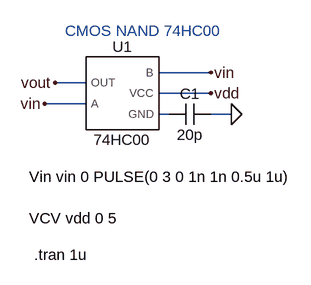
[diagram p0: schematic test74hc00.asc]
test74hc00.asc, the LTspice schematic file:
Version 4
SHEET 1 880 680
WIRE 320 32 240 32
WIRE 128 48 80 48
WIRE 320 64 240 64
WIRE 128 80 64 80
WIRE 256 96 240 96
WIRE 352 96 320 96
FLAG 64 80 vin
FLAG 320 32 vin
FLAG 320 64 vdd
FLAG 352 96 0
FLAG 80 48 vout
SYMBOL AutoGenerated\\CD74HC00 176 64 R0
SYMATTR InstName U1
SYMBOL cap 320 80 R90
WINDOW 0 0 32 VBottom 2
WINDOW 3 32 32 VTop 2
SYMATTR InstName C1
SYMATTR Value 20p
TEXT 40 192 Left 2 !Vin vin 0 PULSE(0 3 0 1n 1n 0.5u 1u)
TEXT 48 312 Left 2 !.tran 1u
TEXT 40 256 Left 2 !VCV vdd 0 5
TEXT 96 -32 Left 2 ;CMOS NAND 74HC00

The netlist it stands for:
* test74hc00.asc
XU1 vout vin vin vdd N001 74HC00  ; pins OUT A B VCC GND
C1 0 N001 20p
Vin vin 0 PULSE(0 3 0 1n 1n 0.5u 1u)
.tran 1u
VCV vdd 0 5
* CMOS NAND 74HC00
.lib C:\Users\RJ\Documents\LTspiceXVII\gates\CD74HC00.cir
.backanno
.end

* Results of the author's LTspice run, read from the files saved beside the schematic
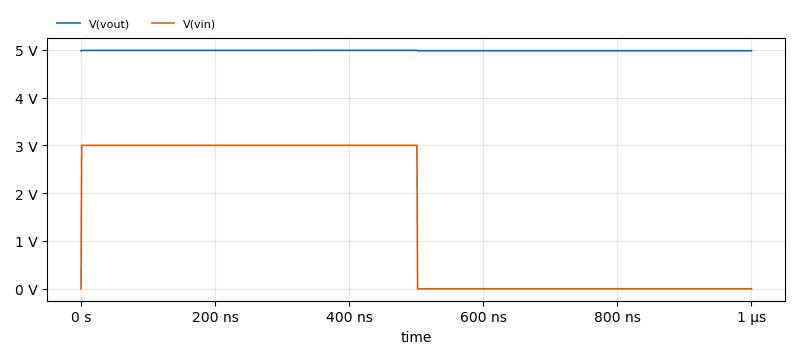
[diagram p1: Transient Analysis of test74hc00.asc, plotted from the saved traces]
* Transient Analysis, 1 run:
*   V(vout): min 4.979 V, max 4.987 V, average 4.982 V, rms 4.982 V, last 4.979 V
*   V(vin): min 0 V, max 3 V, average 1.503 V, rms 2.123 V, last 0 V